# Altium project FSAE_Analog_to_CAN_Converter.PrjPcb
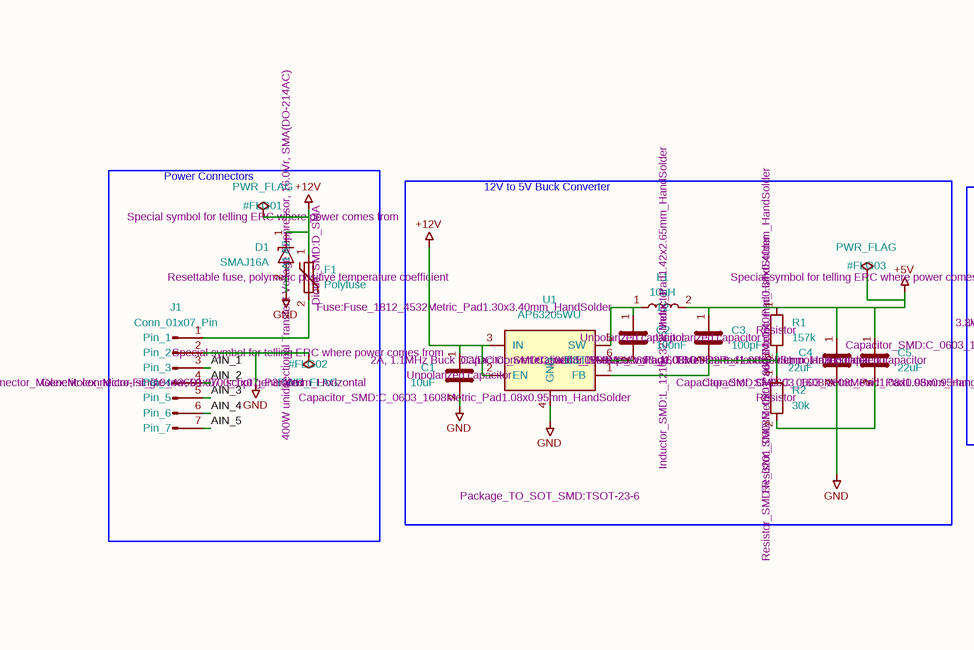
[diagram p0: FSAE_Analog_to_CAN_Converter.SchDoc, top left]
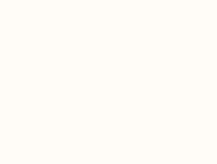
[diagram p1: FSAE_Analog_to_CAN_Converter.SchDoc, bottom left]
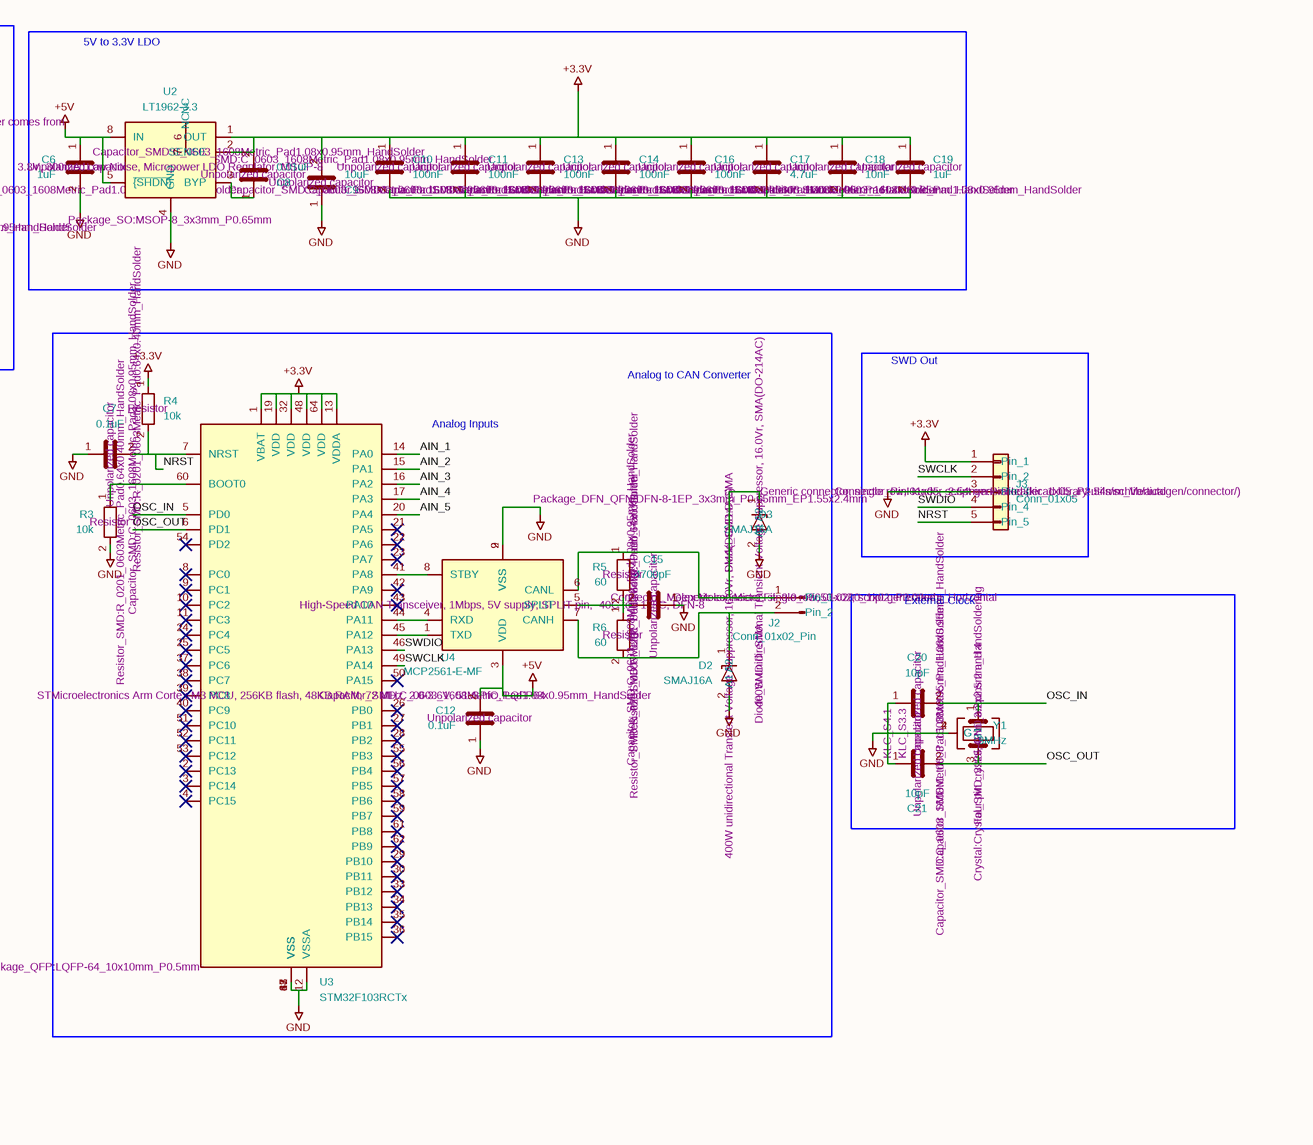
[diagram p2: FSAE_Analog_to_CAN_Converter.SchDoc, bottom right]
1 sheet, 43 parts. Net scope: global (net labels, ports and power ports of the same name join across sheets).

## Sheet FSAE_Analog_to_CAN_Converter.SchDoc
size 420 x 297 mm

### Parts
#FLG01  Description: Special symbol for telling ERC where power comes from  (hidden comment: PWR_FLAG)  (graphical)
#FLG02  Description: Special symbol for telling ERC where power comes from  (hidden comment: PWR_FLAG)  (graphical)
#FLG03  Description: Special symbol for telling ERC where power comes from  (hidden comment: PWR_FLAG)  (graphical)
C1  Description: Unpolarized capacitor  Footprint: Capacitor_SMD:C_0603_1608Metric_Pad1.08x0.95mm_HandSolder  [C_0603_1608Metric_Pad1.08x0.95mm_HandSolder]  (hidden comment: 10uF)
C2  Description: Unpolarized capacitor  Footprint: Capacitor_SMD:C_0603_1608Metric_Pad1.08x0.95mm_HandSolder  [C_0603_1608Metric_Pad1.08x0.95mm_HandSolder]  (hidden comment: 100nF)
C3  Description: Unpolarized capacitor  Footprint: Capacitor_SMD:C_0603_1608Metric_Pad1.08x0.95mm_HandSolder  [C_0603_1608Metric_Pad1.08x0.95mm_HandSolder]  (hidden comment: 100pF)
C4  Description: Unpolarized capacitor  Footprint: Capacitor_SMD:C_0603_1608Metric_Pad1.08x0.95mm_HandSolder  [C_0603_1608Metric_Pad1.08x0.95mm_HandSolder]  (hidden comment: 22uF)
C5  Description: Unpolarized capacitor  Footprint: Capacitor_SMD:C_0603_1608Metric_Pad1.08x0.95mm_HandSolder  [C_0603_1608Metric_Pad1.08x0.95mm_HandSolder]  (hidden comment: 22uF)
C6  Description: Unpolarized capacitor  Footprint: Capacitor_SMD:C_0603_1608Metric_Pad1.08x0.95mm_HandSolder  [C_0603_1608Metric_Pad1.08x0.95mm_HandSolder]  (hidden comment: 1uF)
C7  Description: Unpolarized capacitor  Footprint: Capacitor_SMD:C_0603_1608Metric_Pad1.08x0.95mm_HandSolder  [C_0603_1608Metric_Pad1.08x0.95mm_HandSolder]  (hidden comment: 0.1uF)
C8  Description: Unpolarized capacitor  Footprint: Capacitor_SMD:C_0603_1608Metric_Pad1.08x0.95mm_HandSolder  [C_0603_1608Metric_Pad1.08x0.95mm_HandSolder]  (hidden comment: 0.01uF)
C9  Description: Unpolarized capacitor  Footprint: Capacitor_SMD:C_0603_1608Metric_Pad1.08x0.95mm_HandSolder  [C_0603_1608Metric_Pad1.08x0.95mm_HandSolder]  (hidden comment: 10uF)
C10  Description: Unpolarized capacitor  Footprint: Capacitor_SMD:C_0603_1608Metric_Pad1.08x0.95mm_HandSolder  [C_0603_1608Metric_Pad1.08x0.95mm_HandSolder]  (hidden comment: 100nF)
C11  Description: Unpolarized capacitor  Footprint: Capacitor_SMD:C_0603_1608Metric_Pad1.08x0.95mm_HandSolder  [C_0603_1608Metric_Pad1.08x0.95mm_HandSolder]  (hidden comment: 100nF)
C12  Description: Unpolarized capacitor  Footprint: Capacitor_SMD:C_0603_1608Metric_Pad1.08x0.95mm_HandSolder  [C_0603_1608Metric_Pad1.08x0.95mm_HandSolder]  (hidden comment: 0.1uF)
C13  Description: Unpolarized capacitor  Footprint: Capacitor_SMD:C_0603_1608Metric_Pad1.08x0.95mm_HandSolder  [C_0603_1608Metric_Pad1.08x0.95mm_HandSolder]  (hidden comment: 100nF)
C14  Description: Unpolarized capacitor  Footprint: Capacitor_SMD:C_0603_1608Metric_Pad1.08x0.95mm_HandSolder  [C_0603_1608Metric_Pad1.08x0.95mm_HandSolder]  (hidden comment: 100nF)
C15  Description: Unpolarized capacitor  Footprint: Capacitor_SMD:C_0603_1608Metric_Pad1.08x0.95mm_HandSolder  [C_0603_1608Metric_Pad1.08x0.95mm_HandSolder]  (hidden comment: 4700pF)
C16  Description: Unpolarized capacitor  Footprint: Capacitor_SMD:C_0603_1608Metric_Pad1.08x0.95mm_HandSolder  [C_0603_1608Metric_Pad1.08x0.95mm_HandSolder]  (hidden comment: 100nF)
C17  Description: Unpolarized capacitor  Footprint: Capacitor_SMD:C_0603_1608Metric_Pad1.08x0.95mm_HandSolder  [C_0603_1608Metric_Pad1.08x0.95mm_HandSolder]  (hidden comment: 4.7uF)
C18  Description: Unpolarized capacitor  Footprint: Capacitor_SMD:C_0603_1608Metric_Pad1.08x0.95mm_HandSolder  [C_0603_1608Metric_Pad1.08x0.95mm_HandSolder]  (hidden comment: 10nF)
C19  Description: Unpolarized capacitor  Footprint: Capacitor_SMD:C_0603_1608Metric_Pad1.08x0.95mm_HandSolder  [C_0603_1608Metric_Pad1.08x0.95mm_HandSolder]  (hidden comment: 1uF)
C20  Description: Unpolarized capacitor  Footprint: Capacitor_SMD:C_0603_1608Metric_Pad1.08x0.95mm_HandSolder  [C_0603_1608Metric_Pad1.08x0.95mm_HandSolder]  (hidden comment: 10pF)
C21  Description: Unpolarized capacitor  Footprint: Capacitor_SMD:C_0603_1608Metric_Pad1.08x0.95mm_HandSolder  [C_0603_1608Metric_Pad1.08x0.95mm_HandSolder]  (hidden comment: 10pF)
D1  Description: 400W unidirectional Transient Voltage Suppressor, 16.0Vr, SMA(DO-214AC)  Footprint: Diode_SMD:D_SMA  [D_SMA]  (hidden comment: SMAJ16A)
D2  Description: 400W unidirectional Transient Voltage Suppressor, 16.0Vr, SMA(DO-214AC)  Footprint: Diode_SMD:D_SMA  [D_SMA]  (hidden comment: SMAJ16A)
D3  Description: 400W unidirectional Transient Voltage Suppressor, 16.0Vr, SMA(DO-214AC)  Footprint: Diode_SMD:D_SMA  [D_SMA]  (hidden comment: SMAJ16A)
F1  Description: Resettable fuse, polymeric positive temperature coefficient  Footprint: Fuse:Fuse_1812_4532Metric_Pad1.30x3.40mm_HandSolder  [Fuse_1812_4532Metric_Pad1.30x3.40mm_HandSolder]  (hidden comment: Polyfuse)
J1  Description: Generic connector, single row, 01x07, script generated  Footprint: Connector_Molex:Molex_Micro-Fit_3.0_43650-0700_1x07_P3.00mm_Horizontal  [Molex_Micro-Fit_3.0_43650-0700_1x07_P3.00mm_Horizontal]  (hidden comment: Conn_01x07_Pin)
J2  Description: Generic connector, single row, 01x02, script generated  Footprint: Connector_Molex:Molex_Micro-Fit_3.0_43650-0200_1x02_P3.00mm_Horizontal  [Molex_Micro-Fit_3.0_43650-0200_1x02_P3.00mm_Horizontal]  (hidden comment: Conn_01x02_Pin)
J3  Description: Generic connector, single row, 01x05, script generated (kicad-library-utils/schlib/autogen/connector/)  Footprint: Connector_PinHeader_2.54mm:PinHeader_1x05_P2.54mm_Vertical  [PinHeader_1x05_P2.54mm_Vertical]  (hidden comment: Conn_01x05)
L1  Description: Inductor  Footprint: Inductor_SMD:L_1210_3225Metric_Pad1.42x2.65mm_HandSolder  [L_1210_3225Metric_Pad1.42x2.65mm_HandSolder]  (hidden comment: 10uH)
R1  Description: Resistor  Footprint: Resistor_SMD:R_0201_0603Metric_Pad0.64x0.40mm_HandSolder  [R_0201_0603Metric_Pad0.64x0.40mm_HandSolder]  (hidden comment: 157k)
R2  Description: Resistor  Footprint: Resistor_SMD:R_0201_0603Metric_Pad0.64x0.40mm_HandSolder  [R_0201_0603Metric_Pad0.64x0.40mm_HandSolder]  (hidden comment: 30k)
R3  Description: Resistor  Footprint: Resistor_SMD:R_0201_0603Metric_Pad0.64x0.40mm_HandSolder  [R_0201_0603Metric_Pad0.64x0.40mm_HandSolder]  (hidden comment: 10k)
R4  Description: Resistor  Footprint: Resistor_SMD:R_0201_0603Metric_Pad0.64x0.40mm_HandSolder  [R_0201_0603Metric_Pad0.64x0.40mm_HandSolder]  (hidden comment: 10k)
R5  Description: Resistor  Footprint: Resistor_SMD:R_0201_0603Metric_Pad0.64x0.40mm_HandSolder  [R_0201_0603Metric_Pad0.64x0.40mm_HandSolder]  (hidden comment: 60)
R6  Description: Resistor  Footprint: Resistor_SMD:R_0201_0603Metric_Pad0.64x0.40mm_HandSolder  [R_0201_0603Metric_Pad0.64x0.40mm_HandSolder]  (hidden comment: 60)
U1  Description: 2A, 1.1MHz Buck DC/DC Converter, fixed 5.0V output voltage, TSOT-23-6  Footprint: Package_TO_SOT_SMD:TSOT-23-6  [TSOT-23-6]  (hidden comment: AP63205WU)
U2  Description: 3.3V, 300mA, Low Noise, Micropower LDO Regulator, MSOP-8  Footprint: Package_SO:MSOP-8_3x3mm_P0.65mm  [MSOP-8_3x3mm_P0.65mm]  (hidden comment: LT1962-3.3)
U3  Description: STMicroelectronics Arm Cortex-M3 MCU, 256KB flash, 48KB RAM, 72 MHz, 2.0-3.6V, 51 GPIO, LQFP64  Footprint: Package_QFP:LQFP-64_10x10mm_P0.5mm  [LQFP-64_10x10mm_P0.5mm]  (hidden comment: STM32F103RCTx)
U4  Description: High-Speed CAN Transceiver, 1Mbps, 5V supply, SPLIT pin, -40C to +125C, DFN-8  Footprint: Package_DFN_QFN:DFN-8-1EP_3x3mm_P0.65mm_EP1.55x2.4mm  [DFN-8-1EP_3x3mm_P0.65mm_EP1.55x2.4mm]  (hidden comment: MCP2561-E-MF)
Y1  Description: Four pin crystal, GND on pins 2 and 4  private: KLC_S3.3  private: KLC_S4.1  Footprint: Crystal:Crystal_SMD_3225-4Pin_3.2x2.5mm_HandSoldering  [Crystal_SMD_3225-4Pin_3.2x2.5mm_HandSoldering]  (hidden comment: 8MHz)

### Blocks framed on the sheet
Power Connectors /: #FLG01 #FLG02 D1 F1 J1
12V to 5V Buck Converter: #FLG03 C1-C5 L1 R1 R2 U1
5V to 3.3V LDO: C6 C8-C11 C13 C14 C16-C19 U2
SWD Out: J3
External Clock /: C20 C21 Y1

### Nets
+3.3V: C8.2 C9.2 C10.1 C11.1 C13.1 C14.1 C16.1 C17.1 C18.1 C19.1 J3.1(Pin_1) R4.1 U2.1(OUT) U2.2(SENSE) U3.1(VBAT) U3.13(VDDA) U3.19(VDD) U3.32(VDD) U3.48(VDD) U3.64(VDD)
+5V: #FLG03.1 C3.1 C4.1 C5.1 C6.1 C12.2 L1.2 R1.1 U2.5(~{{SHDN}}) U2.8(IN) U4.3(VDD)
+12V: #FLG01.1 C1.1 D1.1(A1) F1.1 U1.2(EN) U1.3(IN)
GND: #FLG02.1 C1.2 C4.2 C5.2 C6.2 C7.1 C9.1 C10.2 C11.2 C12.1 C13.2 C14.2 C15.1 C16.2 C17.2 C18.2 C19.2 C20.1 C21.1 D1.2(A2) D2.2(A2) D3.2(A2) J1.2(Pin_2) J3.3(Pin_3) R2.2 R3.2 U1.4(GND) U2.4(GND) U3.12(VSSA) U3.18(VSS) U3.31(VSS) U3.47(VSS) U3.63(VSS) U4.2(VSS) U4.9(VSS) Y1.2(G) Y1.4(G)
AIN_1: J1.3(Pin_3) U3.14(PA0)
AIN_2: J1.4(Pin_4) U3.15(PA1)
AIN_3: J1.5(Pin_5) U3.16(PA2)
AIN_4: J1.6(Pin_6) U3.17(PA3)
AIN_5: J1.7(Pin_7) U3.20(PA4)
NRST: C7.2 J3.5(Pin_5) R4.2 U3.7(NRST)
OSC_IN: C20.2 U3.5(PD0) Y1.1
OSC_OUT: C21.2 U3.6(PD1) Y1.3
SWCLK: J3.2(Pin_2) U3.49(PA14)
SWDIO: J3.4(Pin_4) U3.46(PA13)
NetC2_1: C2.1 L1.1 U1.5(SW)
NetC2_2: C2.2 U1.6(BST)
NetC3_2: C3.2 R1.2 R2.1 U1.1(FB)
NetC8_1: C8.1 U2.3(BYP)
NetC15_2: C15.2 R5.2 R6.1 U4.5(SPLIT)
NetD2_1: D2.1(A1) J2.2(Pin_2) R6.2 U4.7(CANH)
NetD3_1: D3.1(A1) J2.1(Pin_1) R5.1 U4.6(CANL)
NetF1_2: F1.2 J1.1(Pin_1)
NetR3_1: R3.1 U3.60(BOOT0)
NetU3_41: U3.41(PA8) U4.8(STBY)
NetU3_44: U3.44(PA11) U4.4(RXD)
NetU3_45: U3.45(PA12) U4.1(TXD)

Not connected (* = marked no-connect by the designer): U2 6(NC) 7(NC); U3 2(PC13)* 3(PC14)* 4(PC15)* 8(PC0)* 9(PC1)* 10(PC2)* 11(PC3)* 21(PA5)* 22(PA6)* 23(PA7)* 24(PC4)* 25(PC5)* 26(PB0)* 27(PB1)* 28(PB2)* 29(PB10)* 30(PB11)* 33(PB12)* 34(PB13)* 35(PB14)* 36(PB15)* 37(PC6)* 38(PC7)* 39(PC8)* 40(PC9)* 42(PA9)* 43(PA10)* 50(PA15)* 51(PC10)* 52(PC11)* 53(PC12)* 54(PD2)* 55(PB3)* 56(PB4)* 57(PB5)* 58(PB6)* 59(PB7)* 61(PB8)* 62(PB9)*

### Notes on the sheet
- Analog to CAN Converter
- (near U3) Analog Inputs
- 1
- 2
- 3
- 4
- 5
- 6
- 7
- 8
- A
- B
- C
- D
- E
- Title:
- File: FSAE_Analog_to_CAN_Converter.kicad_sch
- Sheet: /
- F
- KiCad E.D.A.  kicad (5.1.4)-1
- Size: A3
- Date:
- Rev:
- Id: 1/1

### Library data of the parts
C1-C21 = C
  C1 C9: Value: 10uF
  C2 C10 C11 C13 C14 C16: Value: 100nF
  C3: Value: 100pF
  C4 C5: Value: 22uF
  C6 C19: Value: 1uF
  C7 C12: Value: 0.1uF
  C8: Value: 0.01uF
  C15: Value: 4700pF
  C17: Value: 4.7uF
  C18: Value: 10nF
  C20 C21: Value: 10pF
L1 = L: Value: 10uH
R1-R6 = R
  R1: Value: 157k
  R2: Value: 30k
  R3 R4: Value: 10k
  R5 R6: Value: 60
Y1 = Crystal_GND24: Value: 8MHz
#FLG01 #FLG02 #FLG03 = PWR_FLAG: Value: PWR_FLAG
D1-D3 = SMAJ16A: Value: SMAJ16A
F1 = Polyfuse: Value: Polyfuse
J1 = Conn_01x07_Pin: Value: Conn_01x07_Pin
J2 = Conn_01x02_Pin: Value: Conn_01x02_Pin
J3 = Conn_01x05: Value: Conn_01x05
U1 = AP63205WU: Value: AP63205WU
U2 = LT1962-3.3: Value: LT1962-3.3
U3 = STM32F103RCTx: Value: STM32F103RCTx
U4 = MCP2561-E-MF: Value: MCP2561-E-MF